# EAGLE board InkTime (EAGLE 9.7.0)
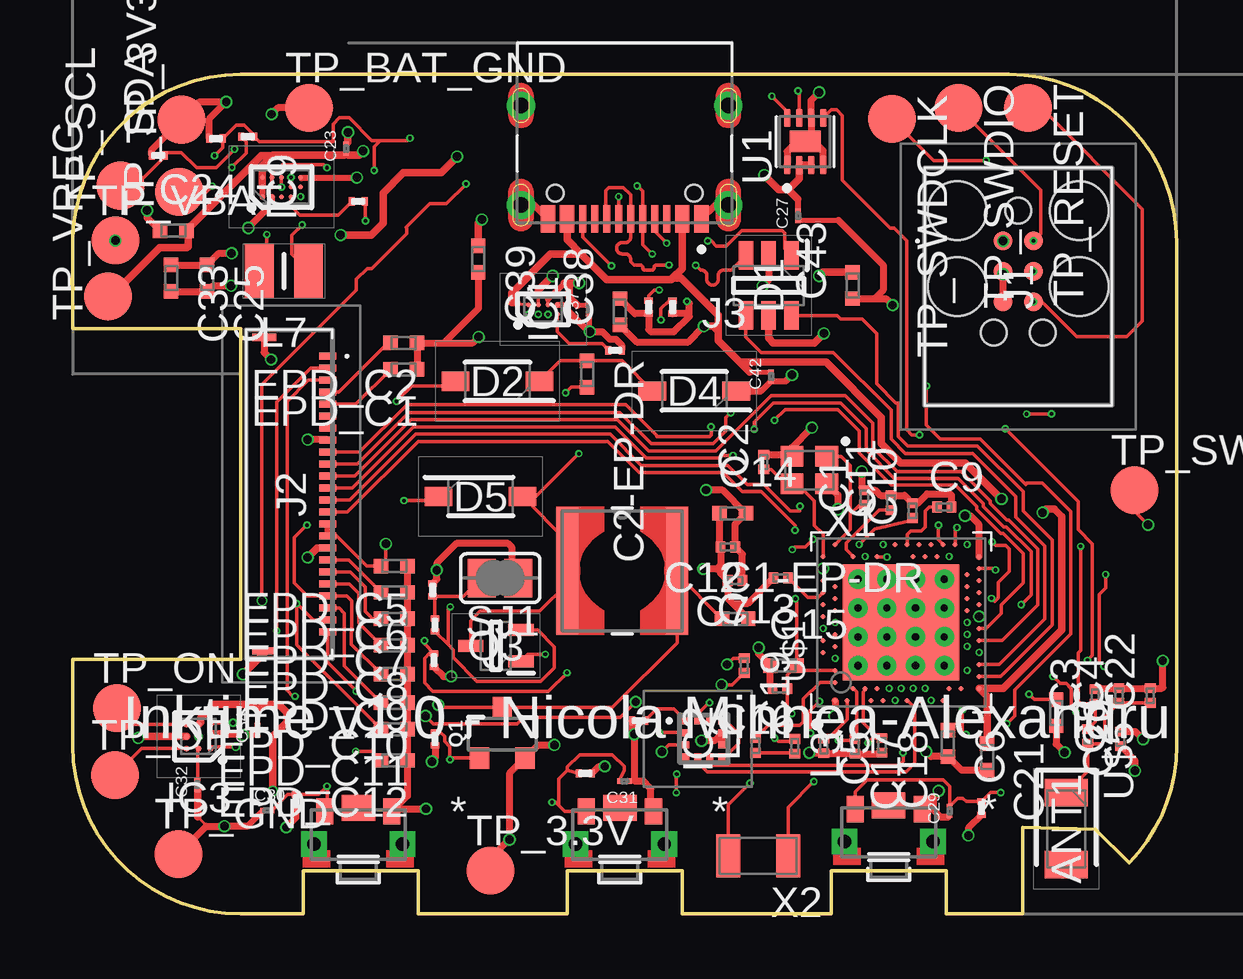
[diagram p2: board, top side]
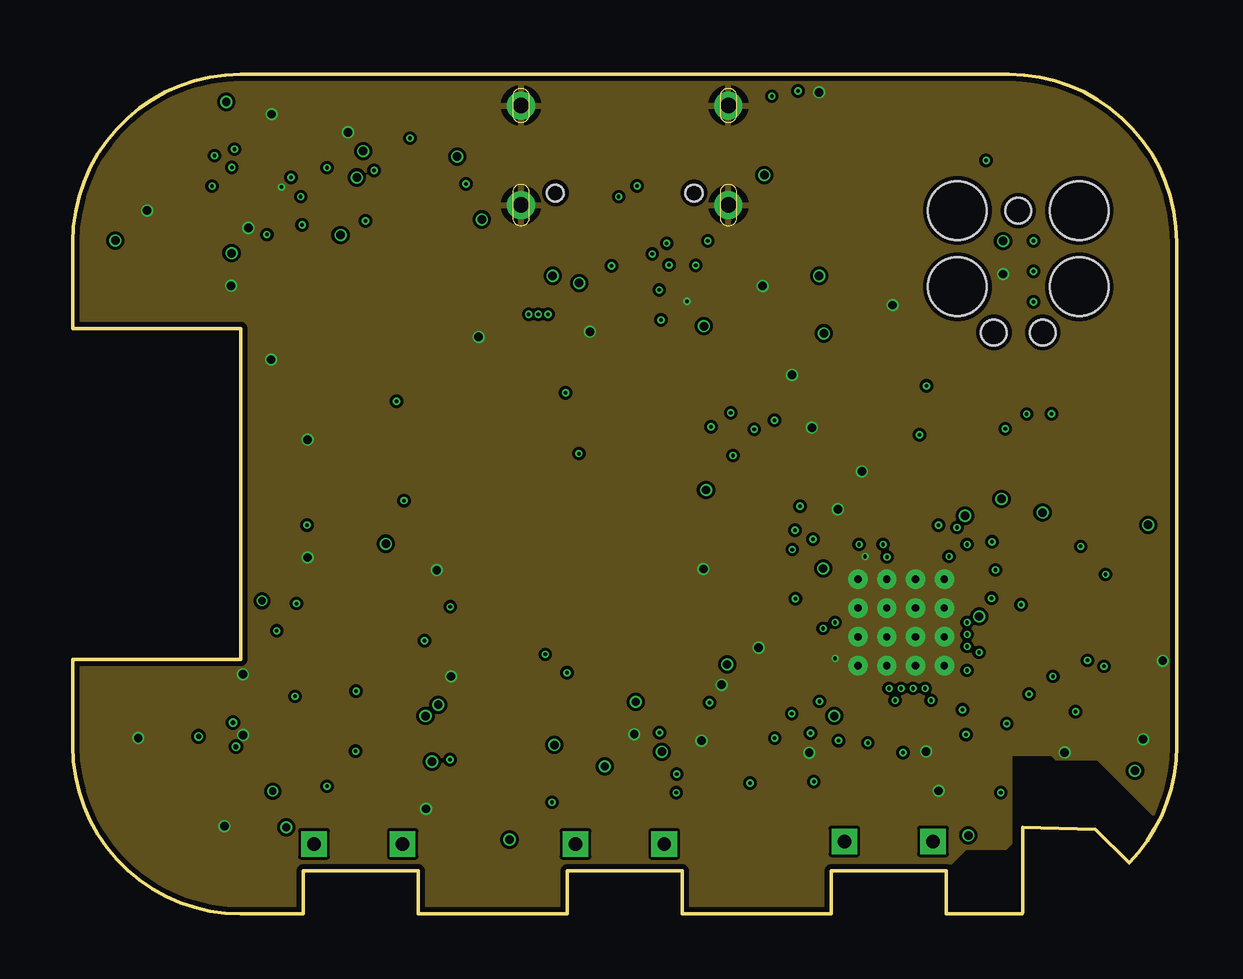
[diagram p3: board, inner layer Route2]
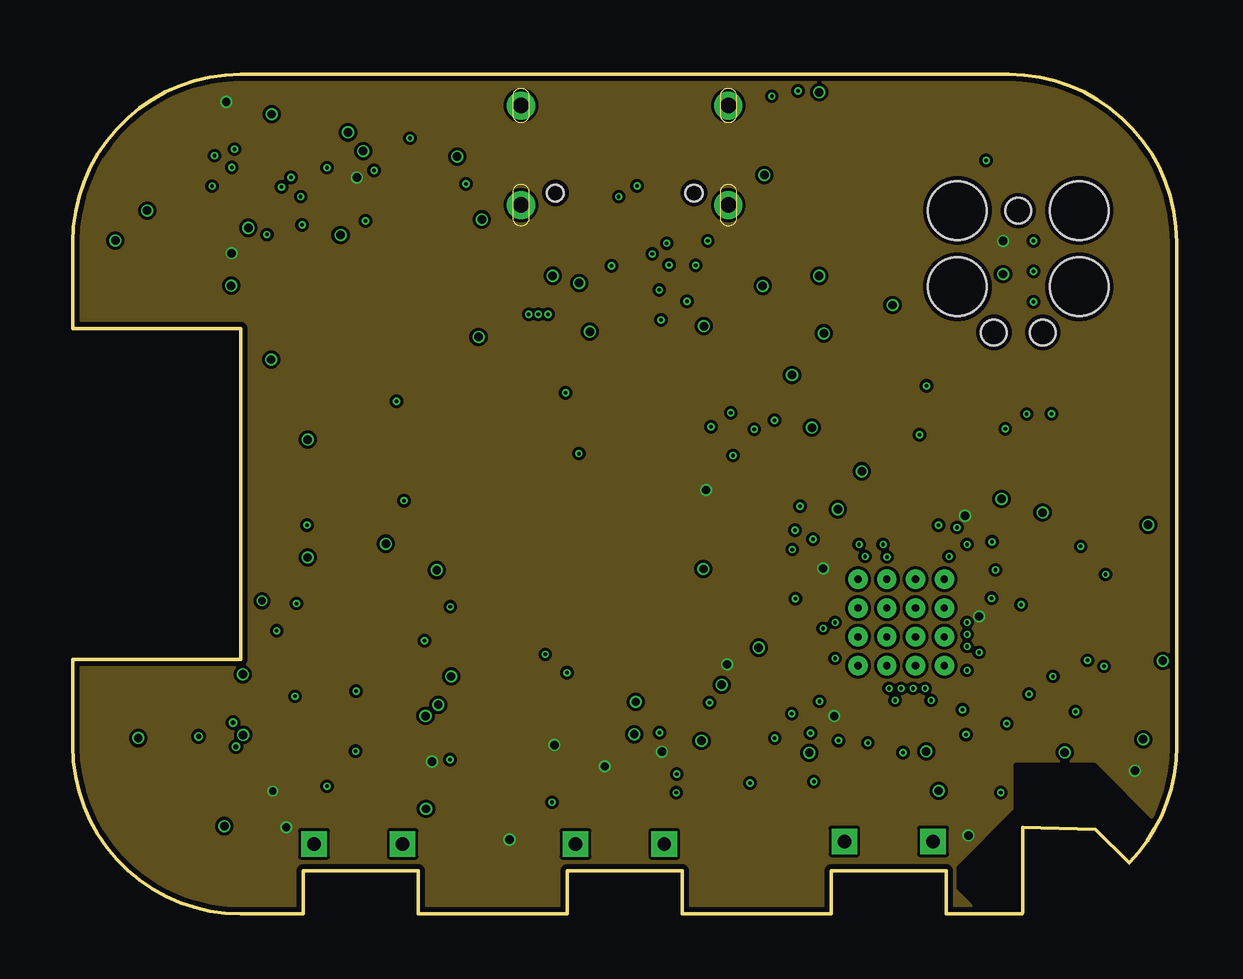
[diagram p4: board, inner layer Route15]
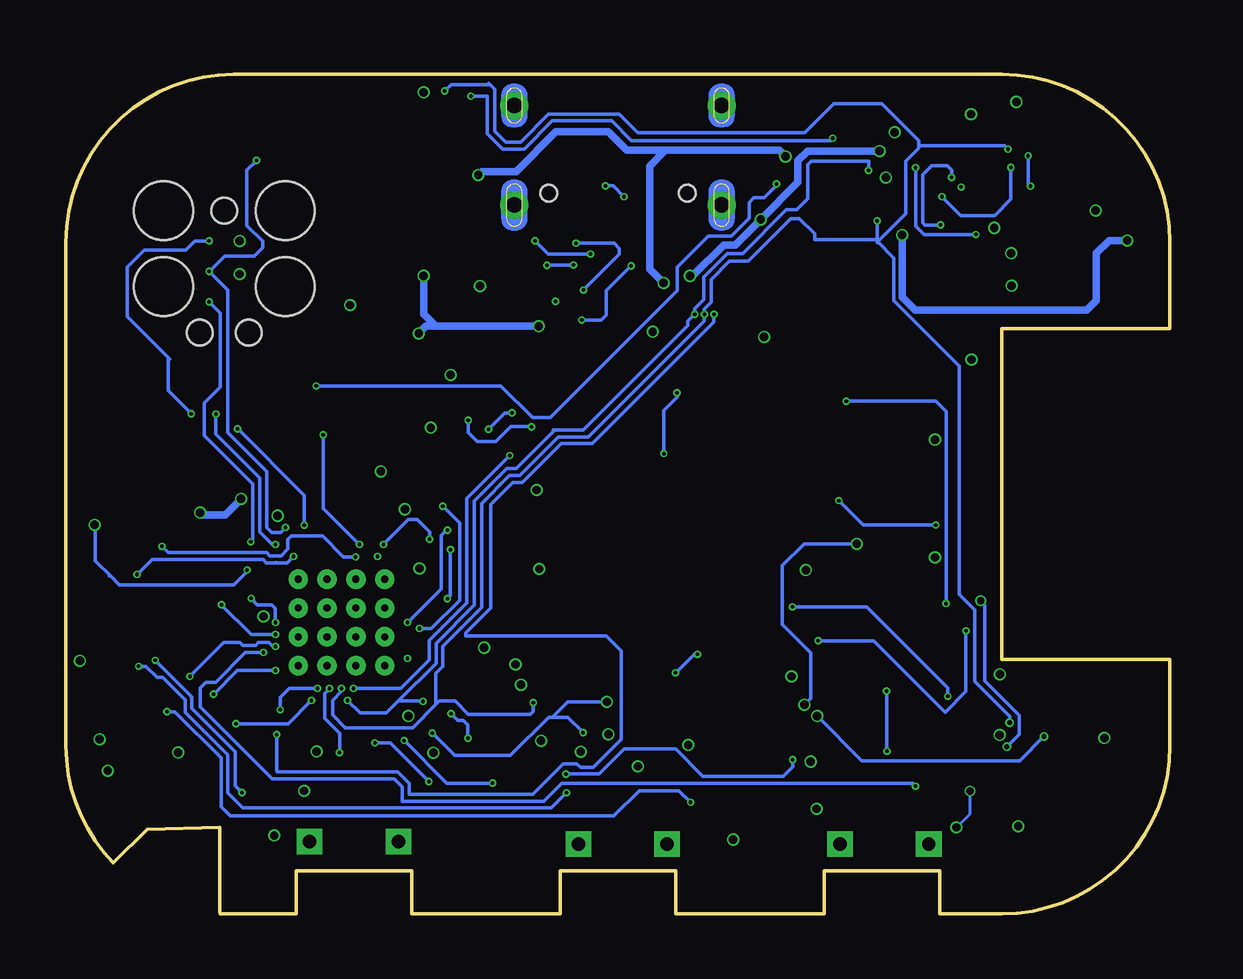
[diagram p5: board, bottom side, seen from below]

Size 46 x 35 mm. Coordinates in mm from the lower left corner, seen from the top.
Outline: 39.57,0 36.4,0 36.4,1.8 31.6,1.8 31.6,0 25.4,0 25.4,1.8 20.6,1.8 20.6,0 14.4,0 14.4,1.8 9.6,1.8 9.6,0 7,0 arc-90 0,7 0,10.6 7,10.6 7,24.4 0,24.4 0,28 arc-90 7,35 39,35 arc-90 46,28 46,7 arc-44 44.02,2.12 42.61,3.53 39.59,3.6 39.59,0.1 39.57,0
Copper layers (1+2*15+16): Top 0.035mm / dielectric 1.6mm / Route2 0.035mm / dielectric 0.15mm / Route15 0.035mm / dielectric 0.2mm / Bottom 0.035mm
Design rules "jlcpcb-2layers.dru *": minimum track width 5mil, minimum drill 0.15mm, track to track 5mil, track to pad 5mil, pad to pad 5mil, via to via 5mil, smd to smd 5mil, copper to edge 0.2mm, drill to drill 6mil, minimum pad ring 10mil, minimum via ring 3mil, stop-mask expansion 4mil, vias tented up to drill 999mm, thermal gap 10mil

## Footprints (pad centres in the part's own frame; a part is rotated, then mirrored left to right if it is on the bottom)
2450AT18B100E_ANTC3216X140N = smd 1.15 x 1.8: 1 -1.5,0; 2 1.5,0
NORDIC_NRF_3_RESC0201_N = smd 0.4 x 0.45: 1 -0.305,0; 2 0.305,0
NORDIC_NRF_3_RESC0402_N = smd 0.6 x 0.6: 1 -0.55,0; 2 0.55,0
GRM011R60J152KE01L_2_CAPC0201X13N = smd 0.22 x 0.23: 1 -0.185,0; 2 0.185,0
ESP32_C6_LIBRARY_3_SOT95P280X145-6N = smd 1.2 x 0.6: 1 -1.25,0.95; 2 -1.25,0; 3 -1.25,-0.95; 4 1.25,-0.95; 5 1.25,0; 6 1.25,0.95
ESP32_C6_LIBRARY_5_SOD3716X135N = smd 1.15 x 0.8: 1 -1.75,0; 2 1.75,0
BQ25180YBGR_BGA8C40P2X4_100X155X50 = smd 0.2 x 0.2: A1 -0.2,0.6; A2 0.2,0.6; B1 -0.2,0.2; B2 0.2,0.2; C1 -0.2,-0.2; C2 0.2,-0.2; D1 -0.2,-0.6; D2 0.2,-0.6
BMA423_BMA423 = smd 0.3 x 0.35: 1 -0.75,-0.775; 2 -0.25,-0.775; 3 0.25,-0.775; 4 0.75,-0.775; 7 0.75,0.775; 8 0.25,0.775; 9 -0.25,0.775; 10 -0.75,0.775 | smd 0.35 x 0.3: 5 0.775,-0.25; 6 0.775,0.25; 11 -0.775,0.25; 12 -0.775,-0.25
DRV2605YZFR_BGA9C50P3X3_144X144X62 = smd 0.25 x 0.25: A1 -0.5,0.5; A2 0,0.5; A3 0.5,0.5; B1 -0.5,0; B2 0,0; B3 0.5,0; C1 -0.5,-0.5; C2 0,-0.5; C3 0.5,-0.5
RT6160AWSC_BGA15C40P3X5_140X230X60 = smd 0.216 x 0.216: A1 -0.4,0.8; A2 0,0.8; A3 0.4,0.8; B1 -0.4,0.4; B2 0,0.4; B3 0.4,0.4; C1 -0.4,0; C2 0,0; C3 0.4,0; D1 -0.4,-0.4; D2 0,-0.4; D3 0.4,-0.4; E1 -0.4,-0.8; E2 0,-0.8; E3 0.4,-0.8
TC2030-IDC_TC2030IDC = smd 0.783 x 0.783: 1 -0.953,-0.635; 2 -0.953,0.635; 3 0.317,-0.635; 4 0.317,0.635; 5 1.588,-0.635; 6 1.588,0.635 | hole 2.451: -2.223,-2.54; -2.223,2.54; 0.952,-2.54; 0.952,2.54 | hole 1.067: -2.223,0; 2.857,-1.016; 2.857,1.016
503480-2400_5034802400 = smd 0.3 x 0.7: 1 -5.75,1.525; 2 -5.25,1.525; 3 -4.75,1.525; 4 -4.25,1.525; 5 -3.75,1.525; 6 -3.25,1.525; 7 -2.75,1.525; 8 -2.25,1.525; 9 -1.75,1.525; 10 -1.25,1.525; 11 -0.75,1.525; 12 -0.25,1.525; 13 0.25,1.525; 14 0.75,1.525; 15 1.25,1.525; 16 1.75,1.525; 17 2.25,1.525; 18 2.75,1.525; 19 3.25,1.525; 20 3.75,1.525; 21 4.25,1.525; 22 4.75,1.525; 23 5.25,1.525; 24 5.75,1.525 | smd 0.3 x 1: MP1 -6.54,-1.125; MP2 6.54,-1.125
KH-TYPE-C-16P_KINGHELM_KH-TYPE-C-16P = smd 0.6 x 1.15: A1_B12 -3.2,4.725; A4_B9 -2.4,4.725; A9_B4 2.4,4.725; A12_B1 3.2,4.725 | smd 0.3 x 1.15: A5 -1.25,4.725; A6 -0.25,4.725; A7 0.25,4.725; A8 1.25,4.725; B5 1.75,4.725; B6 0.75,4.725; B7 -0.75,4.725; B8 -1.75,4.725 | drill 0.65 pad 1.05: SH1 -4.32,0; SH2 4.32,0; SH3 -4.32,4.15; SH4 4.32,4.15 | hole 0.7: -2.89,3.65; 2.89,3.65
ESP32_C6_LIBRARY_2_IND_4828-WE-TPC_WRE = smd 0.9 x 5.3: 1 -2.286,0; 2 2.286,0
NORDIC_NRF_2_RESC0201_N = smd 0.4 x 0.45: 1 -0.305,0; 2 0.305,0
MLP2016SR47MT0S1_INDC2016X100N = smd 1.2 x 2.2: 1 -1.028,0; 2 1.028,0
ESP32_C6_LIBRARY_4_ESP32_C6_LIBRARY_4_ESP32_C6_LIBRARY_4_ESP32_C6_LIBRARY_4_ESP32_WROVER_SPARKFUN-DISCRETESEMI_SOT23-3 = smd 0.8 x 0.9: 1 -0.95,-1; 2 0.95,-1; 3 0,1.1
ESP32_C6_LIBRARY_6_SOT65P210X110-3N = smd 1.05 x 0.5: 1 -1.05,0.65; 2 -1.05,-0.65; 3 1.05,0
CPF0201D7K68C1_0201 = smd 0.35 x 0.25: 1 0,0.275; 2 0,-0.275
ESP32_C6_LIBRARY_7_JUMPER_SJ = smd 1.168 x 1.6: 1 -0.762,0; 2 0.762,0
2025-10-22_07-23-44_LIBRARY_SW_EVP-AKE31A_PAN = smd 0.711 x 1.092: 1 -1.4,-0.972; 2 1.4,-0.972 | drill 0.559 pad 0.914 square: 3 -1.848,0.381; 4 1.848,0.381 | smd 1.397 x 1.092: 5 0,-1.124
HECTOR_WATCH_1_TP20R = smd 2 x 2: TP 0,0
ESP32_C6_LIBRARY_SON50P200X200X80-9N = smd 0.76 x 0.27: 1 -0.985,0.75; 2 -0.985,0.25; 3 -0.985,-0.25; 4 -0.985,-0.75; 5 0.985,-0.75; 6 0.985,-0.25; 7 0.985,0.25; 8 0.985,0.75 | smd 0.9 x 1.3: 9 0,0
NORDIC_NRF_4_AQFN50P700X700X85_HS-74N = smd 4.85 x 4.85: P$74 0,0 | drill 0.3 pad 0.6: P$75 -1.8,1.8; P$76 -0.6,1.8; P$77 0.6,1.8; P$78 1.8,1.8; P$79 -1.8,0.6; P$80 -0.6,0.6; P$81 0.6,0.6; P$82 1.8,0.6; P$83 -1.8,-0.6; P$84 -0.6,-0.6; P$85 0.6,-0.6; P$86 1.8,-0.6; P$87 -1.8,-1.8; P$88 -0.6,-1.8; P$89 0.6,-1.8; P$90 1.8,-1.8 | smd 0.2 x 0.2: P$A8 -1.25,3.25; P$A10 -0.75,3.25; P$A12 -0.25,3.25; P$A14 0.25,3.25; P$A16 0.75,3.25; P$A18 1.25,3.25; P$A20 1.75,3.25; P$A22 2.25,3.25; P$A23 2.75,3.25; P$AA24 3.25,-2.25; P$AB2 -2.75,-2.5; P$AC5 -2,-2.75; P$AC9 -1,-2.75; P$AC11 -0.5,-2.75; P$AC13 0,-2.75; P$AC15 0.5,-2.75; P$AC17 1,-2.75; P$AC19 1.5,-2.75; P$AC21 2,-2.75; P$AC24 3.25,-2.75; P$AD2 -2.75,-3.25; P$AD4 -2.25,-3.25; P$AD6 -1.75,-3.25; P$AD8 -1.25,-3.25; P$AD10 -0.75,-3.25; P$AD12 -0.25,-3.25; P$AD14 0.25,-3.25; P$AD16 0.75,-3.25; P$AD18 1.25,-3.25; P$AD20 1.75,-3.25; P$AD22 2.25,-3.25; P$AD23 2.75,-3.25; P$B1 -3.25,2.75; P$B3 -2.5,2.75; P$B5 -2,2.75; P$B7 -1.5,2.75; P$B9 -1,2.75; P$B11 -0.5,2.75; P$B13 0,2.75; P$B15 0.5,2.75; P$B17 1,2.75; P$B19 1.5,2.75; P$B24 3.25,2.75; P$C1 -3.25,2.25; P$D2 -2.75,2; P$D23 2.75,2; P$E24 3.25,1.75; P$F2 -2.75,1.5; P$F23 2.75,1.5; P$G1 -3.25,1.25; P$H2 -2.75,1; P$H23 2.75,1; P$J1 -3.25,0.75; P$J24 3.25,0.75; P$K2 -2.75,0.5; P$L1 -3.25,0.25; P$L24 3.25,0.25; P$M2 -2.75,0; P$N1 -3.25,-0.25; P$N24 3.25,-0.25; P$P2 -2.75,-0.5; P$P23 2.75,-0.5; P$R1 -3.25,-0.75; P$R24 3.25,-0.75; P$T2 -2.75,-1; P$T23 2.75,-1; P$U1 -3.25,-1.25; P$U24 3.25,-1.25; P$V23 2.75,-1.5; P$W1 -3.25,-1.75; P$W24 3.25,-1.75; P$Y2 -2.75,-2; P$Y23 2.75,-2
NORDIC_NRF_BT-XTAL_2016_N = smd 0.95 x 0.85: 1 -0.725,-0.575; 2 0.725,-0.575; 3 0.725,0.575; 4 -0.725,0.575
NORDIC_NRF_1_XTAL_3215_N = smd 1 x 1.8: 1 -1.25,0; 2 1.25,0

## Placement (x,y rotation side)
ANT1  2450AT18B100E  [2450AT18B100E_ANTC3216X140N]  41.4,3.55 270 top
C1  12pF  [NORDIC_NRF_3_RESC0201_N]  32.99,17.36 90 top
C1-EP-DR  10uF  [NORDIC_NRF_3_RESC0402_N]  27.6,12.3 0 top
C2  12pF  [NORDIC_NRF_3_RESC0201_N]  28.8,18.84 90 top
C2-EP-DR  4.7uF/25V  [NORDIC_NRF_3_RESC0402_N]  21.43,22.51 270 top
C3  1pF  [NORDIC_NRF_3_RESC0201_N]  42.61,9.06 90 top
C4  1pF  [NORDIC_NRF_3_RESC0201_N]  43.6,9.1 90 top
C5  100nF  [NORDIC_NRF_3_RESC0201_N]  31.3,7 270 top
C6  4.7uF  [NORDIC_NRF_3_RESC0402_N]  36.47,7.11 270 top
C7  100nF  [NORDIC_NRF_3_RESC0201_N]  27.6,13.9 180 top
C8  100nF  [NORDIC_NRF_3_RESC0201_N]  43.66,7.3 90 top
C9  820pF  [NORDIC_NRF_3_RESC0201_N]  36.31,16.96 0 top
C10  N.C.  [NORDIC_NRF_3_RESC0201_N]  34.99,16.81 90 top
C11  100pF  [NORDIC_NRF_3_RESC0201_N]  34.1,17.14 90 top
C12  100nF  [NORDIC_NRF_3_RESC0201_N]  27.3,15.3 180 top
C13  N.C.  [NORDIC_NRF_3_RESC0201_N]  29.5,14 180 top
C14  4.7uF  [NORDIC_NRF_3_RESC0402_N]  27.5,16.7 0 top
C15  1.0uF  [NORDIC_NRF_3_RESC0402_N]  29.62,10.35 0 top
C16  47nF  [NORDIC_NRF_3_RESC0201_N]  29.47,9.39 180 top
C17  12pF  [NORDIC_NRF_3_RESC0201_N]  32.6,6.98 270 top
C18  12pF  [NORDIC_NRF_3_RESC0201_N]  33.72,7.03 270 top
C19  100nF  [NORDIC_NRF_3_RESC0201_N]  27.98,10.35 270 top
C20  4.7uF  [NORDIC_NRF_3_RESC0402_N]  40.98,8.39 270 top
C21  4.7uF  [NORDIC_NRF_3_RESC0402_N]  38.1,6.55 270 top
C22  N.C.  [NORDIC_NRF_3_RESC0201_N]  44.9,9.1 90 top
C23  0.1uF  [GRM011R60J152KE01L_2_CAPC0201X13N]  11.39,31.9 90 top
C24  10uF  [NORDIC_NRF_3_RESC0402_N]  4.19,28.48 0 top
C25  22uF  [NORDIC_NRF_3_RESC0402_N]  5.6,26.5 270 top
C27  0.1uF  [GRM011R60J152KE01L_2_CAPC0201X13N]  30.22,29.1 90 top
C29  1uF  [GRM011R60J152KE01L_2_CAPC0201X13N]  36.54,4.29 90 top
C30  1uF  [GRM011R60J152KE01L_2_CAPC0201X13N]  8.1,4.3 0 top
C31  1uF  [GRM011R60J152KE01L_2_CAPC0201X13N]  22.99,5.54 180 top
C32  1uF  [GRM011R60J152KE01L_2_CAPC0201X13N]  5.19,5.39 90 top
C33  22uF  [NORDIC_NRF_3_RESC0402_N]  4.1,26.5 270 top
C34  0.1uF  [GRM011R60J152KE01L_2_CAPC0201X13N]  7.71,7.66 90 top
C37  1uF  [GRM011R60J152KE01L_2_CAPC0201X13N]  21.5,25.2 90 top
C38  1uF  [NORDIC_NRF_3_RESC0402_N]  22.8,25.1 90 top
C39  10uF  [NORDIC_NRF_3_RESC0402_N]  16.9,27.3 270 top
C42  0.1uF  [GRM011R60J152KE01L_2_CAPC0201X13N]  29.1,22.4 90 top
C43  4.7uF  [NORDIC_NRF_3_RESC0402_N]  32.5,26.2 90 top
D1  ESP32_C6_LIBRARY_3_USBLC6-2SC6YCAPSULE  [ESP32_C6_LIBRARY_3_SOT95P280X145-6N]  29,26.2 270 top
D2  MBR0530  [ESP32_C6_LIBRARY_5_SOD3716X135N]  17.7,22.2 180 top
D4  MBR0530  [ESP32_C6_LIBRARY_5_SOD3716X135N]  25.9,21.8 180 top
D5  MBR0530  [ESP32_C6_LIBRARY_5_SOD3716X135N]  17,17.4 0 top
EPD_C1  1uF/50V  [NORDIC_NRF_3_RESC0402_N]  13.8,22.7 180 top
EPD_C2  1uF/50V  [NORDIC_NRF_3_RESC0402_N]  13.8,23.8 180 top
EPD_C5  0.1uF/50V  [NORDIC_NRF_3_RESC0402_N]  13.4,14.5 180 top
EPD_C6  1uF/50V  [NORDIC_NRF_3_RESC0402_N]  13.4,13.4 180 top
EPD_C7  1uF/50V  [NORDIC_NRF_3_RESC0402_N]  13.4,12.3 180 top
EPD_C8  1uF/50V  [NORDIC_NRF_3_RESC0402_N]  13.4,11.2 180 top
EPD_C9  1uF/50V  [NORDIC_NRF_3_RESC0402_N]  13.4,10 180 top
EPD_C10  1uF/50V  [NORDIC_NRF_3_RESC0402_N]  13.4,8.8 180 top
EPD_C11  1uF/50V  [NORDIC_NRF_3_RESC0402_N]  13.4,7.7 180 top
EPD_C12  1uF/50V  [NORDIC_NRF_3_RESC0402_N]  13.4,6.4 180 top
IC1  BQ25180YBGR_BQ25180YBGR  [BQ25180YBGR_BGA8C40P2X4_100X155X50]  19.6,25.2 90 top
IC2  BMA423  [BMA423_BMA423]  26.3,7.3 270 top
IC3  DRV2605YZFR  [DRV2605YZFR_BGA9C50P3X3_144X144X62]  5.25,7.4 180 top
IC9  RT6160AWSC  [RT6160AWSC_BGA15C40P3X5_140X230X60]  8.7,30.3 90 top
J1  TC2030-IDC_TC2030-IDC  [TC2030-IDC_TC2030IDC]  39.4,27.1 270 top
J2  503480-2400_503480-2400  [503480-2400_5034802400]  9.1,17.5 270 top
J3  KH-TYPE-C-16P  [KH-TYPE-C-16P_KINGHELM_KH-TYPE-C-16P]  23,33.7 180 top
L1  68uH  [ESP32_C6_LIBRARY_2_IND_4828-WE-TPC_WRE]  22.9,14.3 0 top
L2  10uH  [NORDIC_NRF_2_RESC0201_N]  28.45,7.02 90 top
L3  15nH  [NORDIC_NRF_2_RESC0201_N]  30.08,6.99 270 top
L7  FTC252012SR47MBCA  [MLP2016SR47MT0S1_INDC2016X100N]  8.8,26.8 0 top
Q1  ESP32_C6_LIBRARY_4_ESP32_WROVER_SPARKFUN-DISCRETESEMI_MOSFET_PCH  [ESP32_C6_LIBRARY_4_ESP32_C6_LIBRARY_4_ESP32_C6_LIBRARY_4_ESP32_C6_LIBRARY_4_ESP32_WROVER_SPARKFUN-DISCRETESEMI_SOT23-3]  17.9,7.5 0 top
Q3  SI1308EDL-T1-GE3  [ESP32_C6_LIBRARY_6_SOT65P210X110-3N]  17.63,11.18 180 top
R1  10K  [CPF0201D7K68C1_0201]  22.6,23.5 90 top
R1_EP_DR  0.47  [CPF0201D7K68C1_0201]  15.09,12.05 0 top
R1_USB  5K1  [CPF0201D7K68C1_0201]  24,25.3 0 top
R2  0  [CPF0201D7K68C1_0201]  7.29,32.4 90 top
R2_EP_DR  10K  [CPF0201D7K68C1_0201]  15.05,10.58 180 top
R2_USB  5K1  [CPF0201D7K68C1_0201]  25,25.3 0 top
R3  0  [CPF0201D7K68C1_0201]  23.58,8.06 270 top
R4  0  [CPF0201D7K68C1_0201]  11.9,29.7 90 top
R5  10k  [CPF0201D7K68C1_0201]  9.3,4.7 0 top
R7  10k  [CPF0201D7K68C1_0201]  37.87,4.41 0 top
R8  10k  [CPF0201D7K68C1_0201]  21.36,5.86 90 top
R17  3K3  [CPF0201D7K68C1_0201]  3.57,31.62 90 top
R18  3K3  [CPF0201D7K68C1_0201]  5.97,32.32 90 top
R_PWR_EPD  10K  [CPF0201D7K68C1_0201]  15.1,7.3 0 top
R_TYPE_SEL  2.2  [CPF0201D7K68C1_0201]  15,13.5 0 top
SJ1  [ESP32_C6_LIBRARY_7_JUMPER_SJ]  17.81,14 180 top
SW_DN  2025-10-22_07-23-44_LIBRARY_EVP-AKE31A  [2025-10-22_07-23-44_LIBRARY_SW_EVP-AKE31A_PAN]  34,3.4 180 top
SW_ENT  2025-10-22_07-23-44_LIBRARY_EVP-AKE31A  [2025-10-22_07-23-44_LIBRARY_SW_EVP-AKE31A_PAN]  22.8,3.3 180 top
SW_UP  2025-10-22_07-23-44_LIBRARY_EVP-AKE31A  [2025-10-22_07-23-44_LIBRARY_SW_EVP-AKE31A_PAN]  11.9,3.3 180 top
TP_3.3V  HECTOR_WATCH_1_TPTP20R  [HECTOR_WATCH_1_TP20R]  17.4,1.8 0 top
TP_3V3  HECTOR_WATCH_1_TPTP20R  [HECTOR_WATCH_1_TP20R]  4.54,33.11 90 top
TP_BAT_GND  HECTOR_WATCH_1_TPTP20R  [HECTOR_WATCH_1_TP20R]  9.85,33.6 0 top
TP_GND  HECTOR_WATCH_1_TPTP20R  [HECTOR_WATCH_1_TP20R]  4.4,2.5 0 top
TP_ON  HECTOR_WATCH_1_TPTP20R  [HECTOR_WATCH_1_TP20R]  1.85,8.57 0 top
TP_OP  HECTOR_WATCH_1_TPTP20R  [HECTOR_WATCH_1_TP20R]  1.77,5.78 0 top
TP_RESET  HECTOR_WATCH_1_TPTP20R  [HECTOR_WATCH_1_TP20R]  39.8,33.6 270 top
TP_SCL  HECTOR_WATCH_1_TPTP20R  [HECTOR_WATCH_1_TP20R]  2,30.36 90 top
TP_SDA  HECTOR_WATCH_1_TPTP20R  [HECTOR_WATCH_1_TP20R]  4.44,30.09 90 top
TP_SWDCLK  HECTOR_WATCH_1_TPTP20R  [HECTOR_WATCH_1_TP20R]  34.13,33.15 270 top
TP_SWDIO  HECTOR_WATCH_1_TPTP20R  [HECTOR_WATCH_1_TP20R]  36.9,33.6 270 top
TP_SWO  HECTOR_WATCH_1_TPTP20R  [HECTOR_WATCH_1_TP20R]  44.25,17.66 0 top
TP_VBAT  HECTOR_WATCH_1_TPTP20R  [HECTOR_WATCH_1_TP20R]  1.78,28.07 0 top
TP_VREG  HECTOR_WATCH_1_TPTP20R  [HECTOR_WATCH_1_TP20R]  1.47,25.74 90 top
U1  MAX17048G+T10  [ESP32_C6_LIBRARY_SON50P200X200X80-9N]  30.52,32.2 90 top
U$1  NRF52840_QF  [NORDIC_NRF_4_AQFN50P700X700X85_HS-74N]  34.52,12.15 90 top
U$5  3.9nH  [NORDIC_NRF_2_RESC0201_N]  42.3,7.4 270 top
X1  32MHz  [NORDIC_NRF_BT-XTAL_2016_N]  30.7,18.5 180 top
X2  32.768kHz  [NORDIC_NRF_1_XTAL_3215_N]  28.56,2.42 180 top

## Tracks (layer width: path | path; a pad name or v marks a point on that pad's centre or on a via)
3V3  (via drill 0.3, 0.35 pad 0.3)
  Top 0.15: 9.53,30.67 IC9.E3
  Top 0.152: IC2.3 24.84,7.05 v24.55,6.76 | C19.1 27.52,10.66 v27.27,10.4
  Top 0.2: C34.2 7.71,8.48
  Top 0.254: 11.81,30.67 9.53,30.67
  Top 0.3: U$1.P$B1 31.77,8.29 v31.73,8.25 | C8.1 44.26,6.39 v44.26,5.97 | R_PWR_EPD.2 15.1,6.48 v14.97,6.35 | v20.07,7.04 19.39,7.04 Q1.2 18.2,5.85 v18.2,3.1 17.4,2.3 TP_3.3V.TP | v6.62,27.54 6.09,27.54 C25.1 C33.1 | R5.2 9.3,4.01 v8.9,3.61 | R8.2 21.93,6.15 v22.17,6.15 | R7.2 37.32,3.59 v37.32,3.27 | C7.1 27.91,15 C12.1 27.61,16.25 C14.2 27.08,17.67 v26.39,17.67 | TP_3V3.TP 5.28,33.85 v6.4,33.85 5.7,33.14 R18.1 | R17.1 3.3,31.87 TP_3V3.TP | 4.91,33.11 TP_3V3.TP | U$1.P$AD23 37.77,16.23 37.4,16.6 v37.18,16.6 | 11.81,30.67 v11.84,30.7
  Top 0.305: IC3.C2 5.34,7.99 5.34,8.17 5.91,8.74 7.45,8.74 7.71,8.48 7.96,8.73 8.59,8.73 8.93,8.39 8.93,8 8.33,7.4 v8.33,5.12
  Bottom 0.127: v8.33,5.12 8.33,4.16 8.84,3.66 v8.9,3.61
  other vias: 37.77,12.4 38.77,28.05 31.27,14.4
  pour Route15: 45.3,3.7 48.62,3.7 48.62,31.59 48.64,31.61 58.77,41.74 -8.35,41.74 -10.26,39.83 -10.26,1.52 1.51,-10.25 10.53,-1.24 10.55,-1.22 39,-1.22 36.77,1.01 36.75,1.03 36.75,1.99 36.77,2.01 39.13,4.38 39.13,6.25 39.15,6.27 39.25,6.37 39.27,6.39 42.6,6.39 42.62,6.37
ALERT  (via drill 0.15 pad 0.2)
  Top 0.15: U1.5 31.61,33.52 31.83,33.52 32.07,33.28 32.07,30.58 34.07,28.58 34.23,28.58 34.75,28.06 34.75,20.19 34.97,19.97 v35.28,19.97
  Bottom 0.15: v35.28,19.97 35.28,16.91 U$1.P$J24
  other vias: 33.77,15.4
D+
  Top 0.15: D1.4 28.05,24.05 28.7,23.4 31.7,23.4 34.1,21 34.1,19.8 34.7,19.2 37.5,19.2 39.3,17.4 39.3,16.54 40.51,15.33 40.51,12.3 38.61,10.4 U$1.P$AD6
D-
  Top 0.15: D1.6 31.85,24.95 32,24.8 32.9,24.8 33.5,24.2 33.5,22.1 34.3,21.3 34.4,21.3 34.4,19.9 34.8,19.5 37.7,19.5 39.6,17.6 39.6,16.8 40.81,15.59 40.81,12.04 38.67,9.9 U$1.P$AD4
DEC1
  Top 0.15: U$1.P$C1 32.27,8.11 31.46,7.3 C5.1
DEC4_6  (via drill 0.15 pad 0.2)
  Top 0.15: U$1.P$E24 33.42,16.05 34.86,16.38 C10.1 | U$1.P$B5 30.37,10.15 C15.2 | C16.1 29.86,9.3 | C15.2 29.77,9.96 C16.1 | C16.1 29.77,8.54 v29.96,8.35 | v29.25,7.33 29.39,7.19 29.98,7.19 L3.1 | C15.2 30.17,13.08 v30.11,13.14 | v29.98,15.19 30.09,15.3 30.53,15.3 v30.85,15.62
  Bottom 0.15: v29.96,8.35 29.68,8.07 29.45,8.07 29.25,7.87 v29.25,7.33 | v30.11,13.14 29.98,13.27 v29.98,15.19 | v30.85,15.62 30.85,15.93 31.36,16.44 31.73,16.44 U$1.P$E24
  other vias: 32.77,15.4
DN  (via drill 0.15 pad 0.2)
  Top 0.15: D1.1 29.67,27.73 29.67,28.39 29.57,28.49 27.88,28.49 27.23,27.84 26.82,27.84 26.6,28.06 v26.46,28.06 | v24.15,27.51 23.75,27.91 J3.B7 23.75,30.12 v23.52,30.35 | J3.A7 v22.75,29.9
  Bottom 0.15: v26.46,28.06 25.91,27.51 v24.15,27.51 | v22.75,29.9 23.2,30.35 v23.52,30.35
DP  (via drill 0.15 pad 0.2)
  Top 0.15: 27.95,27.45 D1.3 27.44,26.84 27.13,26.84 arc90 26.89,26.61 26.89,26.45 arc-90 26.66,26.22 arc-90 26.43,26.45 26.43,26.61 arc90 26.19,26.84 26.16,26.84 v25.96,27.04 | J3.B6 22.21,29.02 22.21,30.15 22.34,30.28 22.95,30.28 23.25,29.98 J3.A6 23.25,28.22 arc-90 23.02,27.98 22.9,27.98 arc90 22.66,27.75 arc90 22.9,27.52 23.02,27.52 arc-90 23.25,27.28 23.25,27.2 23.4,27.05 23.65,27.05 arc-90 23.75,26.94 arc90 23.86,26.83 24.12,26.83 arc90 24.23,26.94 arc-90 24.33,27.05 v24.85,27.05
  Bottom 0.15: v25.96,27.04 v24.86,27.04 v24.85,27.05
EPD_3V3  (via drill 0.35 pad 0.3)
  Top 0.152: C1-EP-DR.1 25.19,14.16 L1.2 25.19,11.3 22.49,8.6 Q1.3 15.35,8.6 v15.23,8.72 | J2.16 11.01,15.75 12.26,14.5 EPD_C5.2 13.05,14.7 v13.05,15.43
  Top 0.3: J2.15 J2.16
  Bottom 0.152: v15.23,8.72 14.97,8.98 14.97,10.88 16.15,12.06 16.15,14.52 15.24,15.43 v13.05,15.43
EPD_BUSY  (via drill 0.15 pad 0.2)
  Top 0.15: J2.9 11.95,19.25 13.93,21.23 23.04,21.23 24.33,19.94 24.33,19.91 26.55,19.91 26.6,19.96 v26.6,20.31 | v29.24,20.58 29.68,21.02 31.87,21.02 32.77,20.12 32.77,19.21 34.1,17.88 36.77,17.88 37.67,16.98 37.67,16.85 38.67,15.85 38.78,15.85 39.6,15.03 39.6,13.8 38.69,12.89 38.69,12.53 38.06,11.9 U$1.P$AD12
  Bottom 0.15: v26.6,20.31 27.47,20.31 28.09,19.69 28.87,19.69 29.24,20.06 v29.24,20.58
EPD_CS  (via drill 0.15 pad 0.2)
  Top 0.15: J2.12 11.65,17.75 14.2,20.3 22.6,20.3 23.9,19 26.9,19 27.01,19.11 v27.51,19.11
  Bottom 0.15: v27.51,19.11 29.3,17.32 29.3,12.97 30.87,11.4 30.87,10.59 32.06,9.4 U$1.P$K2
  other vias: 34.02,9.4
EPD_DC
  Top 0.15: J2.11 11.75,18.25 14.1,20.6 22.7,20.6 24,19.3 26.8,19.3 29.1,21.6 32.2,21.6 33.34,20.46 33.34,19.45 34.35,18.44 37.02,18.44 38.24,17.22 38.24,17.1 38.92,16.42 39.01,16.42 40.22,15.21 40.22,12.88 38.74,11.4 U$1.P$AD10
EPD_RST  (via drill 0.15 pad 0.2)
  Top 0.15: J2.10 11.85,18.75 14,20.9 22.8,20.9 24.1,19.6 26.7,19.6 27.22,20.12 27.22,20.69 v27.42,20.89 | v28.4,20.2 28.4,20.5 29.2,21.3 32,21.3 33.06,20.24 33.06,19.33 34.23,18.16 36.89,18.16 37.95,17.1 37.95,16.99 38.8,16.14 38.89,16.14 39.93,15.1 39.93,13.3 v39.52,12.89
  Bottom 0.15: v27.42,20.89 27.71,20.89 v28.4,20.2 | v39.52,12.89 38.28,11.65 U$1.P$AC11
  other vias: 37.27,11.65
GDR  (via drill 0.15 pad 0.2)
  Top 0.15: v20.6,10.05 19.82,9.27 15.01,9.27 14.66,9.62 14.66,10.65 14.87,10.86 R2_EP_DR.2 14.66,11.25 v14.66,11.39 | Q3.1 18.97,10.82 v19.69,10.82 | J2.2 9.91,22.75 8.5,21.34 v8.5,11.8
  Bottom 0.15: v14.66,11.39 12.35,11.39 9.37,8.41 8.5,9.28 v8.5,11.8 | v19.69,10.82 19.83,10.82 v20.6,10.05
GND  (via drill 0.15 pad 0.1, 0.15 pad 0.3, 0.35, 0.35 pad 0.3)
  Top 0.127: 5.89,7.5 5.79,7.4 IC3.B1 | 5.22,4.04 5.47,3.78 5.56,3.66 | 5.22,5.18 C32.1 | 4.71,7.34 IC3.B3
  Top 0.15: IC9.C2 IC9.C3
  Top 0.152: C19.2 27.48,9.55 v27.04,9.55
  Top 0.2: C31.1 23.42,5.54
  Top 0.203: C27.1 31.91,28.91 | C23.2 11.47,32.16
  Top 0.25: 7.12,7.47 C34.1
  Top 0.254: IC1.D2 20.37,25.4 | C30.1 7.28,3.66 | C37.1 21.5,24.27 | 28.68,21.8 C42.1 29.71,22.21 | C29.1 36.47,4.03 | IC9.B1 8.3,29.58
  Top 0.3: v35.56,6.77 35.77,6.56 C6.2 37.03,6 C21.2 | SW_DN.1 35.88,4.85 | 35.88,4.85 36.08,5.05 v36.08,5.13 | C3.2 42.65,9.4 C4.2 C22.2 45.39,9.4 45.42,9.44 v45.42,10.55 | C8.2 44.27,7.61 v44.6,7.28 | 20.37,25.4 21.5,24.27 v21.55,24.27 22.07,24.27 22.38,23.96 22.63,23.96 22.88,23.71 R1.2 | EPD_C5.1 EPD_C6.1 EPD_C7.1 EPD_C8.1 EPD_C9.1 EPD_C10.1 EPD_C11.1 EPD_C12.1 13.95,4.92 SW_UP.1 13.41,4.38 v14.72,4.38 | R_TYPE_SEL.1 15.17,13.95 v15.17,14.33 15.17,14.63 15.98,15.44 18.14,15.44 18.31,15.27 18.31,14.26 SJ1.1 | J2.MP1 7.97,23.41 v8.27,23.11 | v6.6,26.19 5.84,26.19 C25.2 C33.2 | C24.1 3.1,29.02 v3.1,29.32 | TP_GND.TP 5.56,3.66 v6.32,3.66 7.28,3.66 | C14.1 26.95,15.35 C12.2 27,14.54 | 27,14.54 27,14.2 C7.2 27.3,13.16 27.5,12.95 | 27.5,12.95 C1-EP-DR.2 | 27.5,12.95 28.14,12.95 C13.2 | 27,14.54 26.84,14.38 v26.28,14.38 | C18.2 33.67,6.68 C17.2 32.58,6.7 C5.2 30.71,6.7 v30.69,6.72 | IC2.8 IC2.9 26.75,7.22 v26.2,7.22 | TP_BAT_GND.TP 8.55,33.6 v8.29,33.34 | C39.2 16.9,25.24 15.46,23.8 | 15.46,23.8 EPD_C2.1 EPD_C1.1 | 15.46,23.8 16.66,23.8 v16.91,24.05 | J3.A12_B1 19.23,29.55 J3.SH4 | J3.A1_B12 26.77,29.55 J3.SH3 | D1.2 29,26.43 v28.75,26.18 | 31.91,28.91 33.77,27.05 33.77,26 33.42,25.65 | C43.1 33.42,25.65 | 33.42,25.65 33.89,25.65 v34.16,25.38 | J1.5 v38.77,26.67 J1.3 | 31.24,17.93 X1.4 31.88,17.47 v31.88,16.87 | X1.2 29.98,19.1 | 29.98,19.1 29.98,19.45 v30.8,20.27 | v32.88,18.45 v32.87,18.44 32.87,17.79 C1.2 33.44,17.66 33.66,17.45 C11.2 34.66,17.45 C10.2 35.2,17.11 35.6,17.51 36.56,17.51 36.62,17.45 C9.2 | C20.2 40.98,7.08 v41.33,6.73 | SW_ENT.1 24.09,4.38 24.09,5.22 23.77,5.54 23.42,5.54 23.42,7.47 v23.4,7.49 23.3,7.59 R3.2
  Top 0.3: J2.8 10.61,19.77 v9.79,19.77 | D4.1 28.68,21.8 | 29.71,22.21 v29.97,22.47 | C2.2 29.93,19.14 29.98,19.1 | 25.69,24.91 25.05,24.27 24.09,24.27 24,24.36 R1_USB.2 23.43,25.02 C38.2 | 25.69,24.91 25.57,25.02 R2_USB.2 | 25.69,24.91 25.69,25.45 v25.6,25.54 | C16.2 29.07,9.48 C15.1 28.58,10.84 v28.58,11.1 | R2_EP_DR.1 15.46,9.9 v15.77,9.9 | 36.47,4.03 36.17,4.03 35.88,4.32 35.88,4.85 | U$1.P$74 U$1.P$81 | U1.9 30.18,32.2 29.77,31.8 U1.1 | U1.9 30.77,32.45 U1.6 30.77,33.92 v31.1,34.25 | U1.4 31.27,31.82 30.89,32.2 U1.9 | 8.3,29.58 v7.32,28.6
  Top 0.305: J2.MP2 7.97,10.88 v7.09,9.99 | J2.17 10.18,15.25 v9.79,14.86 | 11.47,32.16 v11.47,32.58 | 5.22,4.04 5.22,5.18 | IC3.B3 2.8,7.4 v2.73,7.33 | 5.89,7.5 7.06,7.5 v7.1,7.46 7.12,7.47
  other vias: 8.7,30.3 31.77,10.65 33.02,14.9
  pour Route2: 42.71,6.46 42.73,6.44 45.96,3.22 46.41,3.22 59.84,16.65 59.84,44.9 2.92,44.9 -5.49,36.49 -5.49,3.66 9.05,-10.88 23.59,-10.88 37.19,2.71 37.21,2.73 38.87,2.73 39.09,2.95 39.09,6.6 39.11,6.62 39.13,6.64 39.15,6.66 40.77,6.66 40.79,6.64 40.98,6.46
HAPTIC_EN  (via drill 0.15 pad 0.2, 0.2, 0.3)
  Top 0.15: v38.92,7.93 39.25,8.26 39.25,9.34 41.59,11.68 41.59,16.77 40.4,17.96 39.76,17.96 39.71,17.91 37.82,19.8 36.14,19.8 35.57,20.37 v35.57,22.01 | v16.39,30.43 15.56,29.6 14.88,29.6 13.9,28.62 13.92,28.55 13.92,28.36 12.46,26.9 12.27,26.9 11.82,26.45 11.82,26.01 7.89,22.07 v7.89,13.05 | v6.8,6.97 5.8,6.97 IC3.A1
  Bottom 0.15: U$1.P$U1 36.74,7.93 v38.92,7.93 | v35.57,22.01 27.88,22.01 26.55,20.68 25.82,20.68 20.52,25.98 20.52,26.97 19.23,28.26 18.27,28.26 17.53,29 17.53,29.66 17.34,29.85 16.91,29.85 16.39,30.37 v16.39,30.43 | v6.8,6.97 6.29,7.48 6.29,8.28 7.72,9.71 7.72,12.86 7.89,13.03 v7.89,13.05
  other vias: 35.77,8.9
IMU_INT1
  Top 0.15: U$1.P$N1 35.09,8.58 35.09,6.29 34.72,5.92 26.44,5.92 26.05,6.31 IC2.5
IMU_INT2  (via drill 0.15 pad 0.2)
  Top 0.15: v34.6,6.72 34.6,6.35 34.45,6.2 26.57,6.2 26.55,6.22 IC2.6
  Bottom 0.15: U$1.P$P2 35.22,9.2 35.22,8.15 34.6,7.53 v34.6,6.72
  other vias: 35.02,9.4
LX1  (via drill 0.15 pad 0.2)
  Top 0.15: IC9.B2 IC9.B3 8.3,30.81 8.73,31.24 10.47,31.24 v10.6,31.11 | v8.09,28.32 8.09,27.12 L7.1
  Bottom 0.15: v10.6,31.11 10.6,28.68 10.24,28.32 v8.09,28.32
LX2  (via drill 0.15 pad 0.2)
  Top 0.15: IC9.D2 IC9.D3 | v9.56,28.72 9.13,28.29 9.12,28.29 9.12,27.51 L7.2
  Bottom 0.15: IC9.D3 9.1,31.01 9.29,31.2 9.93,31.2 10.31,30.82 10.31,28.82 10.21,28.72 v9.56,28.72
  other vias: 9.1,30.7
MOSI  (via drill 0.15 pad 0.2)
  Top 0.15: J2.14 11.45,16.75 14.4,19.7 22.3,19.7 23.6,18.4 27.1,18.4 27.9,17.6 28.7,17.6 30.1,16.2 v30.1,16
  Bottom 0.15: v30.1,16 30.13,16 30.36,15.77 30.36,13.55 U$1.P$B13
  other vias: 31.77,12.15
N$1  (via drill 0.15 pad 0.2)
  Top 0.15: v39.85,9.16 40.07,8.94 C20.1
  Bottom 0.15: U$1.P$AC5 38.86,10.15 v39.85,9.16
  other vias: 37.27,10.15
N$2
  Top 0.15: IC9.D1 9.1,29.5 9.47,29.13 11.05,29.13 R4.1
N$3
  Top 0.15: C32.2 5.22,5.63 5.22,6.39 5.22,6.9 IC3.A2
N$4  (via drill 0.15 pad 0.2)
  Top 0.15: v6.63,31.12 7.23,31.72 7.23,32.19 R2.1
  Bottom 0.15: IC9.E1 8.71,29.11 7.31,29.11 6.63,29.79 v6.63,31.12
  other vias: 9.5,29.9
N$5
  Top 0.15: R1.1 22.05,23.77 20.7,23.77 20.2,24.27 IC1.D1
N$7
  Top 0.15: U$1.P$W1 36.47,8.7 C6.1
N$8
  Top 0.15: IC2.10 27.21,8.05 27.76,7.51 27.76,7.11 27.2,6.55 IC2.7
N$9
  Top 0.15: U$1.P$B3 31.14,9.65 30.45,8.96 30.45,8 30.3,7.85 28.98,7.85 L2.2
N$10
  Top 0.15: L2.1 30.05,6.71 L3.2
N$11
  Top 0.15: R3.1 24.34,8.54 25.04,8.54 IC2.1
N$12
  Top 0.15: U$1.P$D23 32.23,15.19 32.23,15.46 33.61,16.84 C11.1
N$13
  Top 0.15: U$1.P$A23 31.27,15.83 30.9,16.2 30.9,17.21 30.18,17.93 X1.3 30,17.9 29.75,17.9 29.12,18.54 C2.1
N$14
  Top 0.15: C13.1 29.82,14 30.62,13.2 31.07,13.2 U$1.P$A18
N$16
  Top 0.15: X1.1 32.02,19.07 32.4,18.7 32.4,16.67 | 32.4,16.67 32.4,16.03 U$1.P$B24 | 32.4,16.67 32.78,17.05 C1.1
N$17  (via drill 0.15 pad 0.2)
  Top 0.15: v42,15.32 42,10.99 41.89,10.88 41.89,8.89 42.02,8.76 C3.1 42.61,8.02 U$5.1
  Top 0.152: v33.93,14.88 33.54,14.88 U$1.P$H23
  Bottom 0.15: v42,15.32 41.74,15.06 37.64,15.06 37.51,14.93 37.03,14.93 36.75,15.21 36.75,15.61 36.61,15.75 35.31,15.75 34.44,14.88 v33.93,14.88
N$18  (via drill 0.15 pad 0.2)
  Top 0.15: Q3.3 16.58,12.21 16.99,12.62 19.47,12.62 20.61,13.76 L1.1 20.61,15.54 D5.2 19.3,17.4 v21.09,19.19 | v20.54,21.72 20.78,21.96 C2-EP-DR.2
  Bottom 0.15: v21.09,19.19 21.09,20.99 20.54,21.54 v20.54,21.72
N$19
  Top 0.15: U$1.P$N24 34.77,15.82 34.91,15.96 35.35,15.96 35.52,16.13 35.52,16.8 35.68,16.96 C9.1
N$20
  Top 0.15: D4.2 22.89,23.06 C2-EP-DR.1 20.31,23.06 D2.1
N$22
  Top 0.15: J2.4 11.09,21.75 13.13,23.8 EPD_C2.2
N$23
  Top 0.15: J2.5 11.8,21.25 EPD_C1.2
N$25
  Top 0.15: R1_EP_DR.1 15.09,13.13 R_TYPE_SEL.2 16.27,13.22 SJ1.2
N$28  (via drill 0.15 pad 0.2)
  Top 0.15: J3.A5 24.25,28.46 v24.75,27.96 | v24.44,26.01 24.23,26.01 24,25.78 R1_USB.1
  Bottom 0.15: v24.75,27.96 23.16,27.96 22.94,27.74 22.94,27.51 v24.44,26.01
N$29  (via drill 0.15 pad 0.2)
  Top 0.15: J3.B5 21.25,28.22 v22.45,27.02 | v24.51,24.76 24.51,25.23 24.86,25.57 R2_USB.1
  Bottom 0.15: v22.45,27.02 23.48,25.99 23.48,24.97 23.69,24.76 v24.51,24.76
N$31
  Top 0.15: J2.22 11.1,12.75 11.32,12.53 11.32,10.33 EPD_C10.2
N$32
  Top 0.15: J2.18 11.51,14.75 EPD_C6.2
N$33
  Top 0.15: 10.9,14.25 J2.19 10.63,14.26 11.57,14.26 12.2,13.63 12.2,12.6 12.5,12.3 EPD_C7.2
N$34
  Top 0.15: J2.20 11.52,13.75 11.91,13.36 11.91,12.14 EPD_C8.2
N$38  (via drill 0.15 pad 0.2)
  Top 0.15: J2.24 10.62,10.47 v11.81,9.29 | v11.79,6.78 12.47,6.78 EPD_C12.2
  Bottom 0.15: v11.81,9.29 11.81,6.8 v11.79,6.78
OUT+
  Top 0.15: TP_OP.TP 1.79,5.82 2.87,6.9 4.71,6.9 IC3.A3 4.78,6.9
OUT-
  Top 0.15: TP_ON.TP 1.86,8.55 2.49,7.91 4.71,7.91 IC3.C3 4.78,7.91
P0.00/XL1  (via drill 0.15 pad 0.2)
  Top 0.15: U$1.P$D2 32.66,9.26 32.66,7.35 C17.1 32.55,7.23 v31.91,7.23 | X2.2 27.31,4.54 v28.22,5.45
  Bottom 0.15: v28.22,5.45 30.13,5.45 v31.91,7.23
P0.01/XL2  (via drill 0.15 pad 0.2)
  Top 0.15: U$1.P$F2 33.02,9.34 32.94,9.26 32.94,7.96 33.56,7.34 C18.1 33.34,7.34 v33.13,7.13 | X2.1 29.81,4.45 v30.88,5.52
  Bottom 0.15: v30.88,5.52 32.49,7.13 v33.13,7.13
P0.13  (via drill 0.15 pad 0.2)
  Top 0.15: SW_UP.2 10.6,4.37 v10.6,5.32 10.26,4.97 R5.1 8.96,4.97 C30.2
  Bottom 0.15: U$1.P$AD8 38.52,10.9 39.76,9.66 40.18,9.66 40.41,9.43 40.41,8.64 37.41,5.64 32.33,5.64 31.98,5.29 31.98,4.7 26.09,4.7 25.35,5.44 10.72,5.44 v10.6,5.32
  other vias: 37.77,10.9
P0.14  (via drill 0.15 pad 0.2)
  Top 0.15: v40.84,9.9 41.14,9.6 41.39,9.6 41.6,9.39 41.6,8.62 v41.79,8.43 | SW_ENT.2 20.51,4.27 20.25,4.53 | v19.97,4.65 20.13,4.65 20.25,4.53 | 20.25,4.53 20.25,5.62 20.61,5.97 | 20.61,5.97 R8.1 | C31.2 22.8,5.65 22.98,5.99 22.98,6.14 22.49,6.64 21.12,6.64 20.61,6.12 20.61,5.97
  Bottom 0.15: U$1.P$AC9 37.39,11.15 37.55,11.31 37.98,11.31 38.09,11.2 38.64,11.2 38.75,11.31 39.43,11.31 v40.84,9.9 | v41.79,8.43 41.46,8.43 39.54,6.51 39.54,4.47 39.15,4.08 23.18,4.08 22.12,5.14 20.46,5.14 v19.97,4.65
  other vias: 37.27,11.15
P1.01  (via drill 0.15 pad 0.2)
  Top 0.15: v43.04,14.15 43.04,13.58 42.77,13.31 42.77,10.52 v42.97,10.32 | v25.15,5.05 25.15,5.81 v25.17,5.83 | Q1.1 15.79,6.5 v15.72,6.43 15.72,6.96 15.49,7.18 15.49,7.39 15.31,7.57 R_PWR_EPD.1
  Bottom 0.15: U$1.P$Y23 36.78,14.64 37.25,14.64 | 37.26,14.65 37.25,14.64 | 37.25,14.64 37.65,14.64 37.79,14.78 42.41,14.78 v43.04,14.15 | v42.97,10.32 42.67,10.32 42.2,9.85 41.97,9.85 41.04,8.92 41.04,8.41 39.25,6.62 39.25,5.04 38.63,4.42 25.78,4.42 v25.15,5.05 | v25.17,5.83 23.78,5.83 22.74,6.87 20.6,6.87 19.47,5.74 16.11,5.74 15.72,6.13 v15.72,6.43
  other vias: 36.52,14.9
P1.02  (via drill 0.15 pad 0.2)
  Top 0.15: U$1.P$W24 36.07,15.6 v36.07,16.2 | v38.86,20.23 41.89,17.19 41.89,16.02 42.49,15.42 42.49,10.78 v42.28,10.57 | v38.67,5.06 38.24,5.06 R7.1 37.23,4.69 37.09,4.82 36.88,4.82 C29.2 36.54,5.31 36.27,5.59 33.1,5.59 32.6,5.09 SW_DN.2
  Bottom 0.15: v36.07,16.2 36.07,17.45 v38.85,20.23 v38.86,20.23 | v42.28,10.57 40.75,9.04 40.75,8.56 38.94,6.75 38.94,5.33 v38.67,5.06
PMIC_INT  (via drill 0.15 pad 0.2)
  Top 0.15: v37.07,8.51 37.07,7.63 v37.22,7.48
  Bottom 0.15: U$1.P$T2 36.69,9.4 37.07,9.02 v37.07,8.51 | v37.22,7.48 37.22,5.95 37.19,5.92 32.18,5.92 31.7,5.44 31.7,4.99 26.55,4.99 25.28,6.26 24.71,6.26 24.56,6.11 24.03,6.11 22.87,7.27 22.87,10.97 23.48,11.58 29.35,11.58 29.35,11.71 28.31,12.75 28.31,17.06 27.39,17.98 26.99,17.98 25.37,19.6 24.07,19.6 19,24.67 IC1.A1
  other vias: 35.52,9.4 19,25
PREVGH  (via drill 0.15 pad 0.2)
  Top 0.15: EPD_C9.2 11.61,11.24 11.61,11.76 11.62,11.77 11.62,13.04 11.41,13.25 J2.21 9.78,13.25 9.24,13.79 9.24,15.69 v9.76,16.21 | v13.8,17.23 15.08,17.23 D5.1
  Bottom 0.15: v9.76,16.21 12.78,16.21 v13.8,17.23
PREVGL  (via drill 0.15 pad 0.2)
  Top 0.15: J2.23 10.02,12.25 v9.33,12.94 9.33,11.22 EPD_C11.2 | v13.49,21.37 14.13,22.01 15.76,22.01 D2.2
  Bottom 0.15: v9.33,12.94 9.33,20.94 9.76,21.37 v13.49,21.37
RESE  (via drill 0.15 pad 0.2)
  Top 0.15: R1_EP_DR.2 15.64,11.22 | 15.64,11.22 15.85,11.02 15.85,10.69 16.84,9.7 19.51,9.7 20.07,10.26 20.07,11.14 19.38,11.83 Q3.2 | J2.3 9.82,22.25 8.93,21.36 8.93,9.31 9.17,9.07 v9.26,9.07 | v15.73,12.8 15.68,12.8 15.64,12.76 15.64,11.22
  Bottom 0.15: v9.26,9.07 9.26,9.42 12.64,12.8 v15.73,12.8
RESET  (via drill 0.15 pad 0.2)
  Top 0.15: v38.3,15.51 38.46,15.35 38.88,15.35 39.02,15.2 39.02,14.27 38.58,13.82 38.58,13.18 38.42,13.02 v38.28,13.16 | J1.6 40.4,25.51 41.84,24.07 43.91,24.07 44.56,24.72 44.56,29.39 40.35,33.6 TP_RESET.TP
  Bottom 0.15: J1.6 39.58,25.05 39.58,21.95 40.23,21.3 40.23,19.94 38.21,17.92 38.21,15.6 v38.3,15.51 | U$1.P$AC13 37.27,12.74 37.42,12.89 38.02,12.89 v38.28,13.16
  other vias: 40.03,25.51 37.27,12.15
RF
  Top 0.15: C22.1 C4.1 43,8.2 43,7.26 42.84,7.1 U$5.2 42.3,5.95 ANT1.1
SCK  (via drill 0.15 pad 0.2)
  Top 0.15: J2.13 11.55,17.25 14.3,20 22.4,20 23.7,18.7 27.3,18.7 28.1,17.9 28.8,17.9 29.9,16.8 30.3,16.8 v30.3,17
  Bottom 0.15: v30.3,17 29.6,16.3 29.6,13.07 30.77,11.9 U$1.P$A12
  other vias: 31.27,11.9
SCL  (via drill 0.15 pad 0.2, 0.2)
  Top 0.15: v12.2,28.89 12.2,29.68 R4.2 | v6.75,31.88 5.98,31.11 5.16,31.11 4.53,31.74 3.96,31.74 R17.2 3.84,31.57 2.63,30.36 | v30.22,34.31 30.27,34.26 U1.7 | v26.53,8.81 26.05,8.33 IC2.12 | 2.91,30.36 2.63,30.36 | 2.63,30.36 TP_SCL.TP | v6.68,7.97 6.01,7.97 IC3.C1
  Bottom 0.15: U$1.P$M2 34.52,9.28 34.89,8.91 34.89,8.29 34.36,7.76 31.56,7.76 30.59,8.73 | 30.59,8.73 30.45,8.87 29.79,8.87 29.23,8.31 26.66,8.31 26.53,8.44 v26.53,8.81 | 30.59,8.73 30.59,10.03 30.3,10.31 30.3,11.16 28.68,12.78 28.68,17.11 27.52,18.27 27.1,18.27 25.49,19.88 24.23,19.88 19.4,24.71 IC1.B1 19.4,25.22 19.12,25.5 19.12,26.45 18.36,27.21 17.58,27.21 15.8,28.99 15.44,28.99 14.8,28.35 14.8,28.1 14.74,28.1 12.2,28.1 | 12.2,27.99 12.2,28 | 12.2,28 12.2,28.1 | 12.2,28.1 v12.2,28.89 | 12.2,28 12.18,28.02 | 12.18,28.02 11,29.2 11,31.38 10.46,31.91 10.46,32.02 | 10.46,32.02 10.46,32.23 12.01,33.77 14,33.77 15.21,32.56 22.17,32.56 22.95,33.34 25.9,33.34 27.06,32.18 27.68,32.18 28.13,32.63 28.13,34.38 28.32,34.58 | 28.32,34.58 28.39,34.64 | 28.32,34.58 29.95,34.58 v30.22,34.31 | 10.46,32.02 6.89,32.02 v6.75,31.88 | v6.68,7.97 6.68,8.23 8.14,9.69 8.14,12.67 8.78,13.31 8.78,22.83 11.51,25.56 11.51,27.34 12.18,28.02
  other vias: 34.52,9.4 19.4,25
SDA  (via drill 0.15 pad 0.2, 0.2, 0.35)
  Top 0.15: v29.13,34.09 29.77,33.45 U1.8 | v31.12,8.86 30.74,8.48 v30.74,7.54 | v24.45,7.56 IC2.2 | 7.56,32.44 R2.2 | v14.05,32.34 13.94,32.23 12.81,32.23 | 12.81,32.23 12.56,31.98 v12.56,31 | 12.81,32.23 12.47,32.23 11.52,33.19 11.12,33.19 10.85,32.92 10.85,32.19 7.78,32.19 R2.2 | R2.2 7.56,32.46 7.14,32.88 6.8,32.88 R18.2 6.25,31.95 v5.91,31.61 | v5.81,30.34 5.56,30.09 TP_SDA.TP | v23.46,8.84 22.81,8.19 18.8,8.19 18.53,7.92 15.03,7.92 v14.7,8.25
  Bottom 0.15: U$1.P$L1 33.74,8.37 32.66,8.37 32.16,8.87 | 32.16,8.87 30.58,10.45 30.58,11.28 28.98,12.88 28.98,17.21 27.63,18.56 27.23,18.56 25.69,20.1 25.69,20.17 24.44,20.17 20.09,24.52 20.09,24.71 IC1.C1 19.8,25.23 19.43,25.6 19.43,26.54 18.44,27.53 17.8,27.53 15.98,29.35 15.55,29.35 15.09,29.81 15.09,31.24 14.94,31.39 12.56,31.39 v12.56,31 | v14.05,32.34 14.15,32.24 22.44,32.24 23.26,33.06 25.73,33.06 26.9,31.89 27.81,31.89 28.44,32.52 28.44,34.09 v29.13,34.09 | 32.16,8.87 v31.13,8.87 v31.12,8.86 | v30.74,7.54 29.8,6.6 27.49,6.6 25.89,8.2 25.74,8.2 | 25.74,8.2 25.09,8.2 v24.45,7.56 | v5.91,31.61 5.91,30.44 v5.81,30.34 | 25.74,8.2 25.1,8.84 v23.46,8.84 | v14.7,8.25 12.84,6.39 6.26,6.39 IC3.B2
  other vias: 34.27,8.9 19.8,25 5.25,7.4
SWDCLK  (via drill 0.15 pad 0.2)
  Top 0.15: U$1.P$AA24 36.77,16.03 v36.85,16.11 | TP_SWDCLK.TP 35.87,31.41 v38.06,31.41
  Bottom 0.15: v36.85,16.11 37.06,15.9 37.43,15.9 37.64,16.11 37.64,18.45 39.26,20.07 39.26,26.01 J1.4 39.39,27.43 38.15,27.43 37.81,27.77 37.81,28.04 38.46,28.69 38.46,31.01 v38.06,31.41
  other vias: 40.03,26.78
SWDIO  (via drill 0.15 pad 0.2)
  Top 0.15: v40.78,20.85 v40.77,20.84 v39.75,20.84 | TP_SWDIO.TP 40.33,30.17 40.33,28.35 J1.2
  Bottom 0.15: J1.2 40.63,28.05 41,27.68 42.74,27.68 43.45,26.97 43.45,24.9 41.75,23.2 | 41.75,23.2 41.68,23.13 | 41.75,23.2 41.75,21.82 v40.78,20.85 | v39.75,20.84 39.75,20 37.93,18.18 37.93,15.92 37.41,15.4 U$1.P$AC24
  other vias: 40.03,28.05 37.27,15.4
SWO  (via drill 0.15 pad 0.2, 0.35)
  Top 0.15: U$1.P$AD22 38.39,14.4 v38.45,14.34
  Top 0.152: v44.81,16.22 44.25,16.78 TP_SWO.TP
  Bottom 0.15: 44.14,14.09 44.19,14.09 | 44.14,14.09 43.77,13.72 39.01,13.72 38.45,14.28 v38.45,14.34 | 44.77,14.72 44.14,14.09
  Bottom 0.152: v44.81,16.22 44.77,16.18 44.77,14.72
VBAT  (via drill 0.35 pad 0.3)
  Top 0.15: IC1.C2 19.8,25.62
  Top 0.203: 21.02,25.38 C37.2
  Top 0.254: 20.48,26.3 19.8,25.62 | 30.22,29.8 C27.2
  Top 0.305: 20.7,26.3 20.48,26.3 | 20.7,26.3 v21.1,26.3 | 20.7,26.3 20.7,25.7 21.02,25.38 | v28.82,30.8 29.42,30.2 29.82,30.2 | 29.82,30.2 30.22,29.8 | 29.82,30.2 30.27,30.65 U1.2 U1.3 | v16.02,31.57 15.35,30.9 13.78,30.9 12.93,30.05 12.93,28.8 12.43,28.3 v11.16,28.3
  Bottom 0.305: v21.1,26.3 21.67,26.87 21.67,31.18 21.02,31.83 | v28.82,30.8 28.67,30.95 27.24,30.95 25.59,32.6 23.4,32.6 22.63,31.83 21.02,31.83 | 21.02,31.83 16.28,31.83 v16.02,31.57 | v11.16,28.3 v11.15,28.29 11.15,25.71 10.62,25.18 3.46,25.18 3.07,25.57 3.07,27.54 2.54,28.07 TP_VBAT.TP
  other vias: 1.78,28.07
VBUS  (via drill 0.35 pad 0.3)
  Top 0.127: IC1.A2 18.58,25.4 18.5,25.48
  Top 0.203: 28.21,22.59 C42.2
  Top 0.3: 40.9,16.88 41.21,16.57 | C38.1 23.51,23.84 25.64,23.84 v26.3,24.5
  Top 0.305: J3.A9_B4 20.6,28.1 21.2,27.5 | 21.2,27.5 22.25,26.45 24.94,26.45 24.99,26.5 | 24.99,26.5 25.36,26.5 26.9,24.96 26.9,24.3 | 26.9,24.3 26.9,23.9 27.79,23.01 | 27.79,23.01 31.39,23.01 33.7,20.7 33.7,19.6 34.5,18.8 37.2,18.8 v38.7,17.3 | 41.21,16.57 41.21,11.83 38.78,9.4 U$1.P$AD2 38.1,9.07 C21.1 | 21.2,27.5 19.9,27.5 18.29,25.89 18.29,25.48 18.5,25.48 | 27.79,23.01 28.21,22.59 | 26.9,24.3 26.7,24.5 v26.3,24.5 | v31.3,24.2 30.9,23.8 29.2,23.8 29,24 D1.5 | 24.99,26.5 25.4,26.91 J3.A4_B9 | v31.1,26.6 31.25,26.75 C43.2 | v40.41,16.73 40.56,16.88 40.9,16.88
  Bottom 0.305: v38.7,17.3 39.37,16.63 40.31,16.63 v40.41,16.73 | v26.3,24.5 30.6,24.5 | 30.6,24.5 31,24.5 v31.3,24.2 | 30.6,24.5 31.1,25 v31.1,26.6
VREG  (via drill 0.35 pad 0.3)
  Top 0.15: IC1.B2 19.4,26
  Top 0.254: 11.47,31.63 C23.1 11.31,31.64 | IC9.A2 IC9.A1
  Top 0.305: 19.4,26 v20,26.6 | C39.1 16.9,28.8 v17.05,28.95 | v12.1,31.8 11.93,31.63 11.47,31.63 | 11.31,31.64 8.34,31.64 8.3,31.6 | 8.3,31.6 7.86,31.6 C24.2 4.81,28.41 4.81,27.82 4.76,27.77 3.62,27.77 1.59,25.74 TP_VREG.TP | 7.9,30.8 IC9.A3 | IC9.A3 IC9.A2 | IC9.A3 7.9,31.2 8.3,31.6
  Bottom 0.305: v20,26.6 19.89,26.6 18.6,27.89 18.11,27.89 v17.05,28.95 15.5,30.5 15.5,31.4 15.1,31.8 v12.1,31.8

## Text on the board
tPlace: Inktime v1.0 - Nicola Mihnea-Alexandru